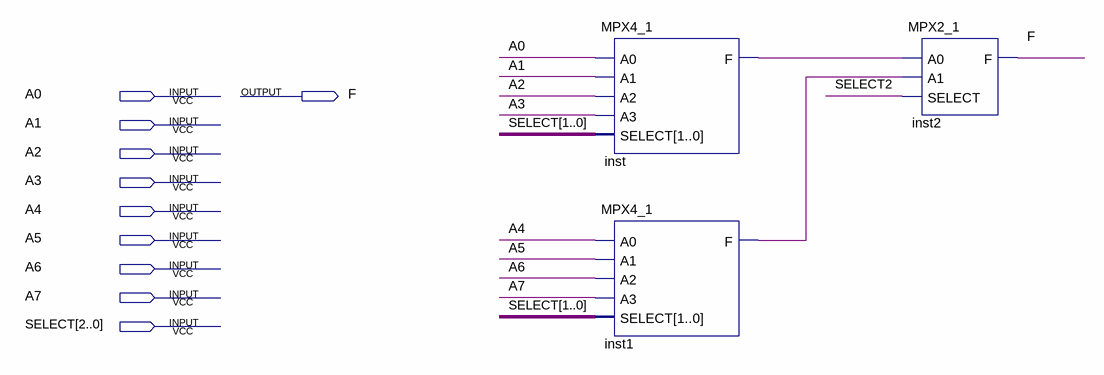
[diagram p0: schematic sheet]
// Quartus schematic MPX8_1.bdf as structural Verilog: 3 symbols, 10 pins
module MPX8_1 (
  input  A0,
  input  A1,
  input  A2,
  input  A3,
  input  A4,
  input  A5,
  input  A6,
  input  A7,
  input  [2:0] SELECT,
  output F
);

  wire inst1_f, inst_f;

  MPX4_1 inst (.A0(A0), .A1(A1), .A2(A2), .A3(A3), .SELECT(SELECT[1:0]), .F(inst_f));
  MPX4_1 inst1 (.A0(A4), .A1(A5), .A2(A6), .A3(A7), .SELECT(SELECT[1:0]), .F(inst1_f));
  MPX2_1 inst2 (.A0(inst_f), .A1(inst1_f), .SELECT(SELECT[2]), .F(F));
endmodule
